# Altium project robobber-altium.PrjPcb
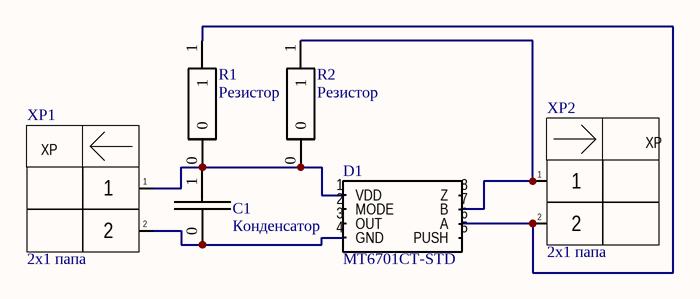
[diagram p0: Схема платы энкодера.SchDoc]
1 sheet, 6 parts. Net scope: global (net labels, ports and power ports of the same name join across sheets).
Board file: Плата энкодера.PcbDoc

## Sheet Схема платы энкодера.SchDoc
size A4; SheetNumber: 1; SheetTotal: 1

### Parts
C1  Конденсатор  [0805 cap]
D1  MT6701CT-STD  [SOP8]
R1  Резистор  [0603 res]
R2  Резистор  [0603 res]
XP1  2x1 папа  [Питание разъём]
XP2  2x1 папа  [Питание разъём]

### Nets
NetC1_0: C1.0 D1.4(GND) XP1.2
NetC1_1: C1.1 D1.1(VDD) R1.0 R2.0 XP1.1
NetD1_6: D1.6(A) R1.1 XP2.2
NetD1_7: D1.7(B) R2.1 XP2.1

Not connected (* = marked no-connect by the designer): D1 2(MODE) 3(OUT) 5(PUSH) 8(Z)

### Notes on the sheet
- (in symbol 2x1 папа) XP

### Library data of the parts
D1 = MT6701CT-STD: Инкрементарный энкодер